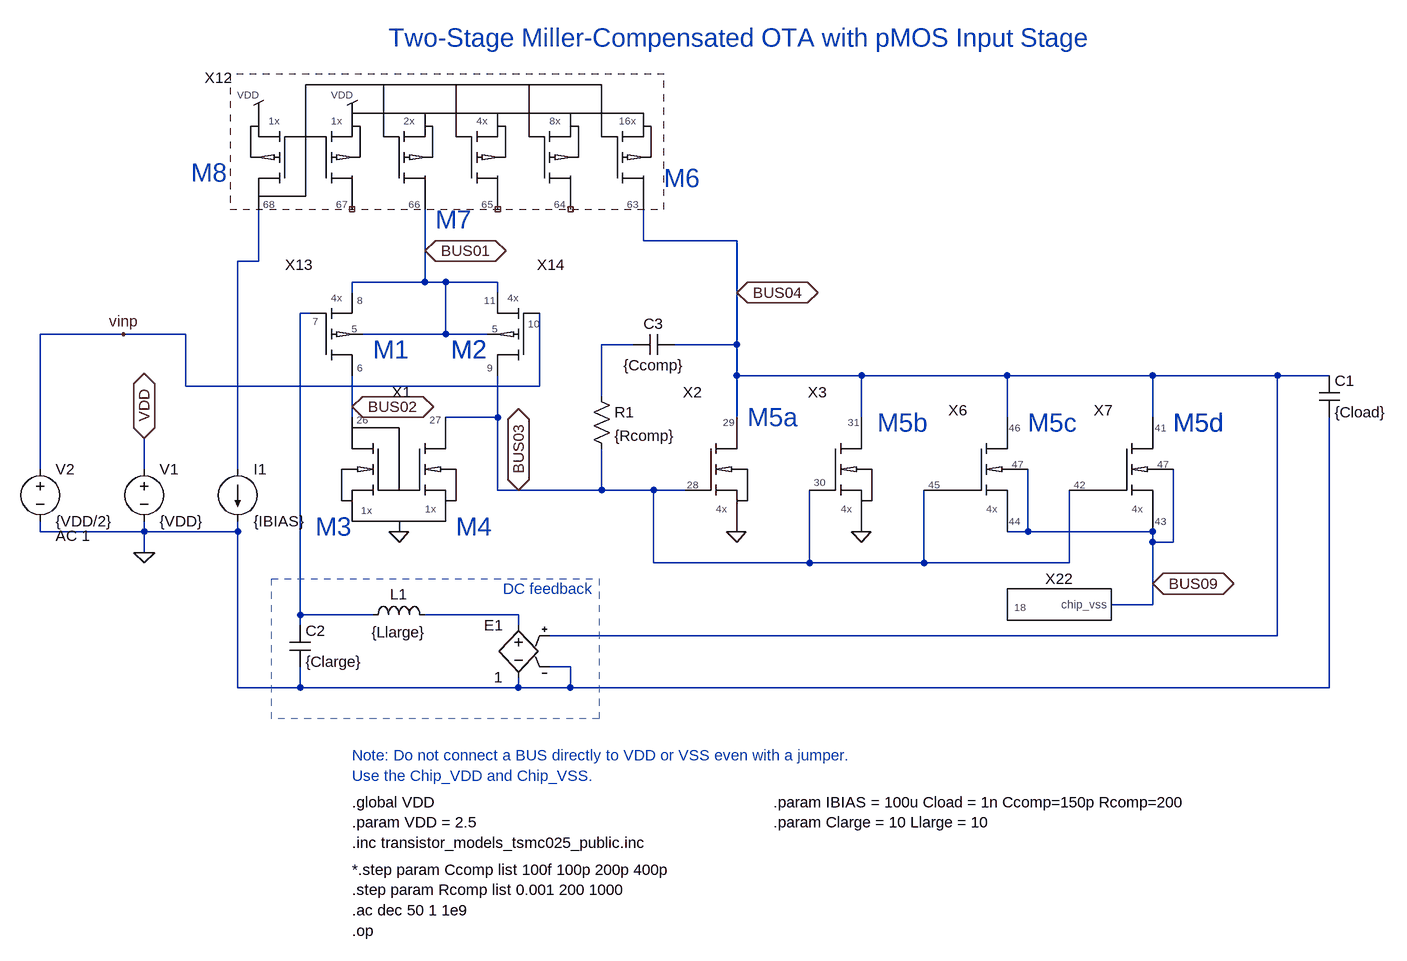
[diagram p0: schematic Miller_OTA_pin.asc]
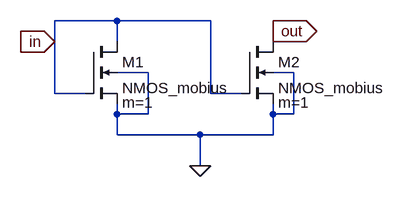
[diagram p1: sub-circuit nmos_currentmirror.asc]
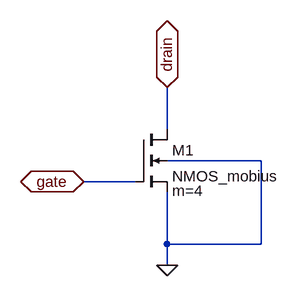
[diagram p2: sub-circuit cs_nmos_4x_a.asc]
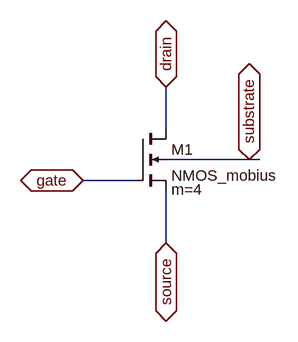
[diagram p3: sub-circuit dp_nmos_4x_b.asc]
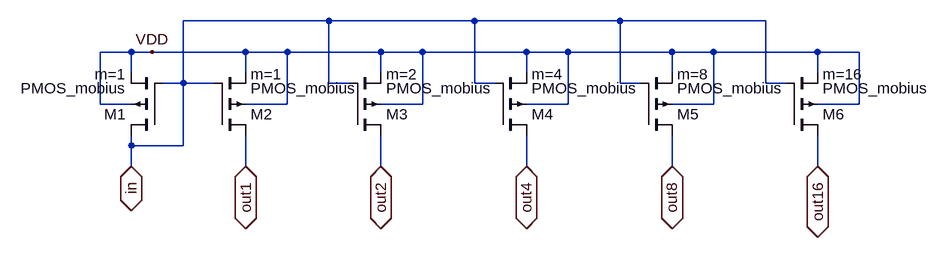
[diagram p4: sub-circuit pmos_currentmirror_array.asc]
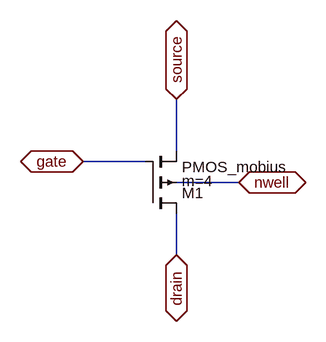
[diagram p5: sub-circuit dp_pmos_4x_a.asc]
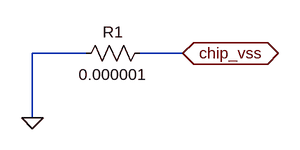
[diagram p6: sub-circuit chip_vss.asc]
Miller_OTA_pin.asc, the LTspice schematic file:
Version 4
SHEET 1 2228 1896
WIRE 1040 848 1040 800
WIRE 1184 848 1040 848
WIRE 704 864 704 800
WIRE 448 880 448 800
WIRE 448 880 416 880
WIRE 704 912 704 864
WIRE 704 912 592 912
WIRE 736 912 704 912
WIRE 816 912 736 912
WIRE 592 928 592 912
WIRE 816 928 816 912
WIRE 1184 928 1184 848
WIRE 528 960 512 960
WIRE 240 992 112 992
WIRE 336 992 240 992
WIRE 736 992 736 912
WIRE 736 992 608 992
WIRE 800 992 736 992
WIRE 1024 1008 976 1008
WIRE 1184 1008 1184 928
WIRE 1184 1008 1088 1008
WIRE 1184 1056 1184 1008
WIRE 1376 1056 1184 1056
WIRE 1600 1056 1376 1056
WIRE 1824 1056 1600 1056
WIRE 2016 1056 1824 1056
WIRE 2096 1056 2016 1056
WIRE 336 1072 336 992
WIRE 880 1072 880 960
WIRE 880 1072 336 1072
WIRE 976 1088 976 1008
WIRE 592 1104 592 1056
WIRE 592 1120 592 1104
WIRE 816 1120 816 1056
WIRE 816 1120 736 1120
WIRE 1184 1120 1184 1056
WIRE 1376 1120 1376 1056
WIRE 1600 1120 1600 1056
WIRE 1824 1120 1824 1056
WIRE 112 1200 112 992
WIRE 272 1200 272 1152
WIRE 416 1200 416 880
WIRE 816 1232 816 1120
WIRE 848 1232 816 1232
WIRE 976 1232 976 1168
WIRE 976 1232 848 1232
WIRE 1056 1232 976 1232
WIRE 1104 1232 1056 1232
WIRE 112 1296 112 1280
WIRE 272 1296 272 1280
WIRE 272 1296 112 1296
WIRE 416 1296 416 1280
WIRE 416 1296 272 1296
WIRE 1632 1296 1632 1200
WIRE 1632 1296 1600 1296
WIRE 1824 1296 1632 1296
WIRE 512 1424 512 960
WIRE 1824 1312 1824 1296
WIRE 1856 1312 1856 1200
WIRE 1856 1312 1824 1312
WIRE 272 1328 272 1296
WIRE 1056 1344 1056 1232
WIRE 1296 1344 1296 1232
WIRE 1296 1344 1056 1344
WIRE 1472 1344 1472 1232
WIRE 1472 1344 1296 1344
WIRE 1696 1344 1696 1232
WIRE 1696 1344 1472 1344
WIRE 1824 1376 1824 1312
WIRE 1824 1408 1824 1376
WIRE 1824 1408 1760 1408
WIRE 624 1424 512 1424
WIRE 848 1424 704 1424
WIRE 512 1440 512 1424
WIRE 848 1440 848 1424
WIRE 2016 1456 2016 1056
WIRE 2016 1456 896 1456
WIRE 928 1504 896 1504
WIRE 416 1536 416 1296
WIRE 512 1536 512 1504
WIRE 512 1536 416 1536
WIRE 848 1536 848 1520
WIRE 848 1536 512 1536
WIRE 928 1536 928 1504
WIRE 928 1536 848 1536
WIRE 2096 1536 2096 1120
WIRE 2096 1536 928 1536
FLAG 704 864 BUS01
IOPIN 704 864 BiDir
FLAG 848 1232 BUS03
IOPIN 848 1232 BiDir
FLAG 1184 928 BUS04
IOPIN 1184 928 BiDir
FLAG 1824 1376 BUS09
IOPIN 1824 1376 BiDir
FLAG 272 1152 VDD
IOPIN 272 1152 BiDir
FLAG 272 1328 0
FLAG 240 992 vinp
FLAG 592 1104 BUS02
IOPIN 592 1104 BiDir
DATAFLAG 1744 1056 "$"
DATAFLAG 624 912 "$"
DATAFLAG 976 1232 "$"
DATAFLAG 512 1184 "$"
DATAFLAG 176 992 "$"
SYMBOL nMOS_currentMirror 688 1152 R0
SYMATTR InstName X1
SYMBOL CS_nMOS_4x_A 1136 1152 R0
SYMATTR InstName X2
SYMBOL DP_nMOS_4x_A 1552 1152 R0
SYMATTR InstName X6
SYMBOL DP_nMOS_4x_B 1776 1152 R0
SYMATTR InstName X7
SYMBOL voltage 272 1184 R0
SYMATTR InstName V1
SYMATTR Value {VDD}
SYMBOL pMOS_currentMirror_array 528 672 R0
WINDOW 0 -142 -59 Bottom 2
SYMATTR InstName X12
SYMBOL CS_nMOS_4x_B 1328 1152 R0
SYMATTR InstName X3
SYMBOL DP_pMOS_4x_A 528 944 R0
SYMATTR InstName X13
SYMBOL DP_pMOS_4x_B 880 944 M0
SYMATTR InstName X14
SYMBOL chip_vss 1680 1408 R0
SYMATTR InstName X22
SYMBOL current 416 1200 R0
SYMATTR InstName I1
SYMATTR Value {IBIAS}
SYMBOL voltage 112 1184 R0
WINDOW 123 24 118 Left 2
SYMATTR Value2 AC 1
SYMATTR InstName V2
SYMATTR Value {VDD/2}
SYMBOL cap 2080 1056 R0
SYMATTR InstName C1
SYMATTR Value {Cload}
SYMBOL cap 496 1440 R0
SYMATTR InstName C2
SYMATTR Value {Clarge}
SYMBOL ind 608 1440 R270
WINDOW 0 32 56 VTop 2
WINDOW 3 5 56 VBottom 2
SYMATTR InstName L1
SYMATTR Value {Llarge}
SYMBOL e 848 1424 M0
SYMATTR InstName E1
SYMATTR Value 1
SYMBOL cap 1088 992 R90
WINDOW 0 0 32 VBottom 2
WINDOW 3 32 32 VTop 2
SYMATTR InstName C3
SYMATTR Value {Ccomp}
SYMBOL res 960 1072 R0
SYMATTR InstName R1
SYMATTR Value {Rcomp}
TEXT 592 1712 Left 2 !.global VDD\n.param VDD = 2.5\n.inc transistor_models_tsmc025_public.inc
TEXT 592 1816 Left 2 !*.step param Ccomp list 100f 100p 200p 400p\n.step param Rcomp list 0.001 200 1000\n.ac dec 50 1 1e9\n.op
TEXT 592 1640 Left 2 ;Note: Do not connect a BUS directly to VDD or VSS even with a jumper. \nUse the Chip_VDD and Chip_VSS.
TEXT 1240 1712 Left 2 !.param IBIAS = 100u Cload = 1n Ccomp=150p Rcomp=200\n.param Clarge = 10 Llarge = 10
TEXT 648 536 Left 4 ;Two-Stage Miller-Compensated OTA with pMOS Input Stage
TEXT 624 1016 Left 4 ;M1
TEXT 744 1016 Left 4 ;M2
TEXT 752 1288 Left 4 ;M4
TEXT 536 1288 Left 4 ;M3
TEXT 1200 1120 Left 4 ;M5a
TEXT 1400 1128 Left 4 ;M5b
TEXT 1632 1128 Left 4 ;M5c
TEXT 1856 1128 Left 4 ;M5d
TEXT 1072 752 Left 4 ;M6
TEXT 720 816 Left 4 ;M7
TEXT 344 744 Left 4 ;M8
TEXT 1856 1128 Left 4 ;M5d
TEXT 744 1016 Left 4 ;M2
TEXT 824 1384 Left 2 ;DC feedback
RECTANGLE Normal 468 1368 972 1584 2

nmos_currentmirror.asc, the sub-circuit schematic file:
Version 4
SHEET 1 880 680
WIRE 112 64 16 64
WIRE 256 64 112 64
WIRE 352 80 352 64
WIRE 16 96 16 64
WIRE 112 96 112 64
WIRE 352 96 352 80
WIRE 160 144 112 144
WIRE 384 144 352 144
WIRE 16 176 16 96
WIRE 64 176 16 176
WIRE 256 176 256 64
WIRE 304 176 256 176
WIRE 112 208 112 192
WIRE 160 208 160 144
WIRE 160 208 112 208
WIRE 352 208 352 192
WIRE 384 208 384 144
WIRE 384 208 352 208
WIRE 112 240 112 208
WIRE 240 240 112 240
WIRE 352 240 352 208
WIRE 352 240 240 240
WIRE 240 288 240 240
FLAG 352 80 out
IOPIN 352 80 Out
FLAG 16 96 in
IOPIN 16 96 In
FLAG 240 288 0
SYMBOL nmos4 64 96 R0
WINDOW 123 56 94 Left 2
SYMATTR InstName M1
SYMATTR Value NMOS_mobius
SYMATTR Prefix X
SYMATTR Value2 m=1
SYMBOL nmos4 304 96 R0
WINDOW 123 56 94 Left 2
SYMATTR InstName M2
SYMATTR Value NMOS_mobius
SYMATTR Prefix X
SYMATTR Value2 m=1

cs_nmos_4x_a.asc, the sub-circuit schematic file:
Version 4
SHEET 1 880 680
WIRE 288 192 288 128
WIRE 432 240 288 240
WIRE 240 272 160 272
WIRE 288 368 288 288
WIRE 432 368 432 240
WIRE 432 368 288 368
WIRE 288 400 288 368
FLAG 288 128 drain
IOPIN 288 128 BiDir
FLAG 160 272 gate
IOPIN 160 272 BiDir
FLAG 288 400 0
SYMBOL nmos4 240 192 R0
WINDOW 123 56 94 Left 2
SYMATTR Value2 m=4
SYMATTR InstName M1
SYMATTR Value NMOS_mobius
SYMATTR Prefix X

dp_nmos_4x_b.asc, the sub-circuit schematic file:
Version 4
SHEET 1 880 680
WIRE 288 192 288 128
WIRE 416 240 288 240
WIRE 432 240 416 240
WIRE 240 272 160 272
WIRE 288 368 288 288
FLAG 288 128 drain
IOPIN 288 128 BiDir
FLAG 288 368 source
IOPIN 288 368 BiDir
FLAG 160 272 gate
IOPIN 160 272 BiDir
FLAG 416 240 substrate
IOPIN 416 240 BiDir
SYMBOL nmos4 240 192 R0
WINDOW 123 56 94 Left 2
SYMATTR Value2 m=4
SYMATTR InstName M1
SYMATTR Value NMOS_mobius
SYMATTR Prefix X

pmos_currentmirror_array.asc, the sub-circuit schematic file:
Version 4
SHEET 1 1552 680
WIRE 640 112 416 112
WIRE 864 112 640 112
WIRE 1088 112 864 112
WIRE 1312 112 1088 112
WIRE 336 160 288 160
WIRE 368 160 336 160
WIRE 512 160 368 160
WIRE 576 160 512 160
WIRE 720 160 576 160
WIRE 784 160 720 160
WIRE 944 160 784 160
WIRE 1008 160 944 160
WIRE 1168 160 1008 160
WIRE 1232 160 1168 160
WIRE 1392 160 1232 160
WIRE 1456 160 1392 160
WIRE 336 192 336 160
WIRE 512 192 512 160
WIRE 720 192 720 160
WIRE 944 192 944 160
WIRE 1168 192 1168 160
WIRE 1392 192 1392 160
WIRE 416 208 416 112
WIRE 416 208 384 208
WIRE 464 208 416 208
WIRE 640 208 640 112
WIRE 672 208 640 208
WIRE 864 208 864 112
WIRE 896 208 864 208
WIRE 1088 208 1088 112
WIRE 1120 208 1088 208
WIRE 1312 208 1312 112
WIRE 1344 208 1312 208
WIRE 288 240 288 160
WIRE 336 240 288 240
WIRE 576 240 576 160
WIRE 576 240 512 240
WIRE 784 240 784 160
WIRE 784 240 720 240
WIRE 1008 240 1008 160
WIRE 1008 240 944 240
WIRE 1232 240 1232 160
WIRE 1232 240 1168 240
WIRE 1456 240 1456 160
WIRE 1456 240 1392 240
WIRE 336 304 336 288
WIRE 416 304 416 208
WIRE 416 304 336 304
WIRE 336 336 336 304
WIRE 512 336 512 288
WIRE 720 336 720 288
WIRE 944 336 944 288
WIRE 1168 336 1168 288
WIRE 1392 336 1392 288
FLAG 368 160 VDD
FLAG 336 336 in
IOPIN 336 336 BiDir
FLAG 512 336 out1
IOPIN 512 336 BiDir
FLAG 720 336 out2
IOPIN 720 336 BiDir
FLAG 944 336 out4
IOPIN 944 336 BiDir
FLAG 1168 336 out8
IOPIN 1168 336 BiDir
FLAG 1392 336 out16
IOPIN 1392 336 BiDir
DATAFLAG 1168 112 "$"
SYMBOL pmos4 384 288 R180
WINDOW 123 56 94 Left 2
SYMATTR Value2 m=1
SYMATTR InstName M1
SYMATTR Value PMOS_mobius
SYMATTR Prefix X
SYMBOL pmos4 464 288 M180
WINDOW 123 56 94 Left 2
SYMATTR Value2 m=1
SYMATTR InstName M2
SYMATTR Value PMOS_mobius
SYMATTR Prefix X
SYMBOL pmos4 672 288 M180
WINDOW 123 56 94 Left 2
SYMATTR Value2 m=2
SYMATTR InstName M3
SYMATTR Value PMOS_mobius
SYMATTR Prefix X
SYMBOL pmos4 896 288 M180
WINDOW 123 56 94 Left 2
SYMATTR Value2 m=4
SYMATTR InstName M4
SYMATTR Value PMOS_mobius
SYMATTR Prefix X
SYMBOL pmos4 1120 288 M180
WINDOW 123 56 94 Left 2
SYMATTR Value2 m=8
SYMATTR InstName M5
SYMATTR Value PMOS_mobius
SYMATTR Prefix X
SYMBOL pmos4 1344 288 M180
WINDOW 123 56 94 Left 2
SYMATTR Value2 m=16
SYMATTR InstName M6
SYMATTR Value PMOS_mobius
SYMATTR Prefix X

dp_pmos_4x_a.asc, the sub-circuit schematic file:
Version 4
SHEET 1 880 680
WIRE 208 256 208 176
WIRE 160 272 64 272
WIRE 304 304 208 304
WIRE 208 416 208 352
FLAG 208 416 drain
IOPIN 208 416 BiDir
FLAG 64 272 gate
IOPIN 64 272 BiDir
FLAG 208 176 source
IOPIN 208 176 BiDir
FLAG 304 304 nwell
IOPIN 304 304 BiDir
SYMBOL pmos4 160 352 M180
WINDOW 123 56 50 Left 2
SYMATTR Value2 m=4
SYMATTR InstName M1
SYMATTR Value PMOS_mobius
SYMATTR Prefix X

chip_vss.asc, the sub-circuit schematic file:
Version 4
SHEET 1 880 680
WIRE 160 272 80 272
WIRE 304 272 240 272
WIRE 80 368 80 272
FLAG 80 368 0
FLAG 304 272 chip_vss
IOPIN 304 272 BiDir
SYMBOL res 256 256 R90
WINDOW 0 0 56 VBottom 2
WINDOW 3 32 56 VTop 2
SYMATTR InstName R1
SYMATTR Value 0.000001

The netlist it stands for:
* Miller_OTA_pin.asc
XX1 BUS02 BUS03 nmos_currentmirror
XX2 BUS03 BUS04 cs_nmos_4x_a
XX6 BUS03 BUS04 BUS09 BUS09 DP_nMOS_4x_A  ; pins gate drain source substrate
XX7 BUS03 BUS04 BUS09 BUS09 dp_nmos_4x_b
V1 VDD 0 {VDD}
XX12 N001 NC_01 BUS01 NC_02 NC_03 BUS04 pmos_currentmirror_array
XX3 BUS03 BUS04 CS_nMOS_4x_B  ; pins gate drain
XX13 BUS02 N002 BUS01 BUS01 dp_pmos_4x_a
XX14 BUS03 vinp BUS01 BUS01 DP_pMOS_4x_B  ; pins drain gate source nwell
XX22 BUS09 chip_vss
I1 N001 0 {IBIAS}
V2 vinp 0 {VDD/2} AC 1
C1 BUS04 0 {Cload}
C2 N002 0 {Clarge}
L1 N002 N004 {Llarge}
E1 N004 0 BUS04 0 1
C3 BUS04 N003 {Ccomp}
R1 N003 BUS03 {Rcomp}

* block symbol definitions
.subckt nmos_currentmirror in out
XM1 in in 0 0 NMOS_mobius m=1  ; pins D G S B
XM2 out in 0 0 NMOS_mobius m=1  ; pins D G S B
.ends nmos_currentmirror

.subckt cs_nmos_4x_a gate drain
XM1 drain gate 0 0 NMOS_mobius m=4  ; pins D G S B
.ends cs_nmos_4x_a

.subckt dp_nmos_4x_b gate drain source substrate
XM1 drain gate source substrate NMOS_mobius m=4  ; pins D G S B
.ends dp_nmos_4x_b

.subckt pmos_currentmirror_array in out1 out2 out4 out8 out16
XM1 in in VDD VDD PMOS_mobius m=1  ; pins D G S B
XM2 out1 in VDD VDD PMOS_mobius m=1  ; pins D G S B
XM3 out2 in VDD VDD PMOS_mobius m=2  ; pins D G S B
XM4 out4 in VDD VDD PMOS_mobius m=4  ; pins D G S B
XM5 out8 in VDD VDD PMOS_mobius m=8  ; pins D G S B
XM6 out16 in VDD VDD PMOS_mobius m=16  ; pins D G S B
.ends pmos_currentmirror_array

.subckt dp_pmos_4x_a drain gate source nwell
XM1 drain gate source nwell PMOS_mobius m=4  ; pins D G S B
.ends dp_pmos_4x_a

.subckt chip_vss chip_vss
R1 chip_vss 0 0.000001
.ends chip_vss

.global VDD
.param VDD = 2.5
.inc transistor_models_tsmc025_public.inc
*.step param Ccomp list 100f 100p 200p 400p
.step param Rcomp list 0.001 200 1000
.ac dec 50 1 1e9
.op
* Note: Do not connect a BUS directly to VDD or VSS even with a jumper.
* Use the Chip_VDD and Chip_VSS.
.param IBIAS = 100u Cload = 1n Ccomp=150p Rcomp=200
.param Clarge = 10 Llarge = 10
* Two-Stage Miller-Compensated OTA with pMOS Input Stage
* M1
* M2
* M4
* M3
* M5a
* M5b
* M5c
* M5d
* M6
* M7
* M8
* M5d
* M2
* DC feedback
.backanno
.end